# EAGLE schematic jetson (EAGLE 8.4.0)

## Sheet 1 of 2
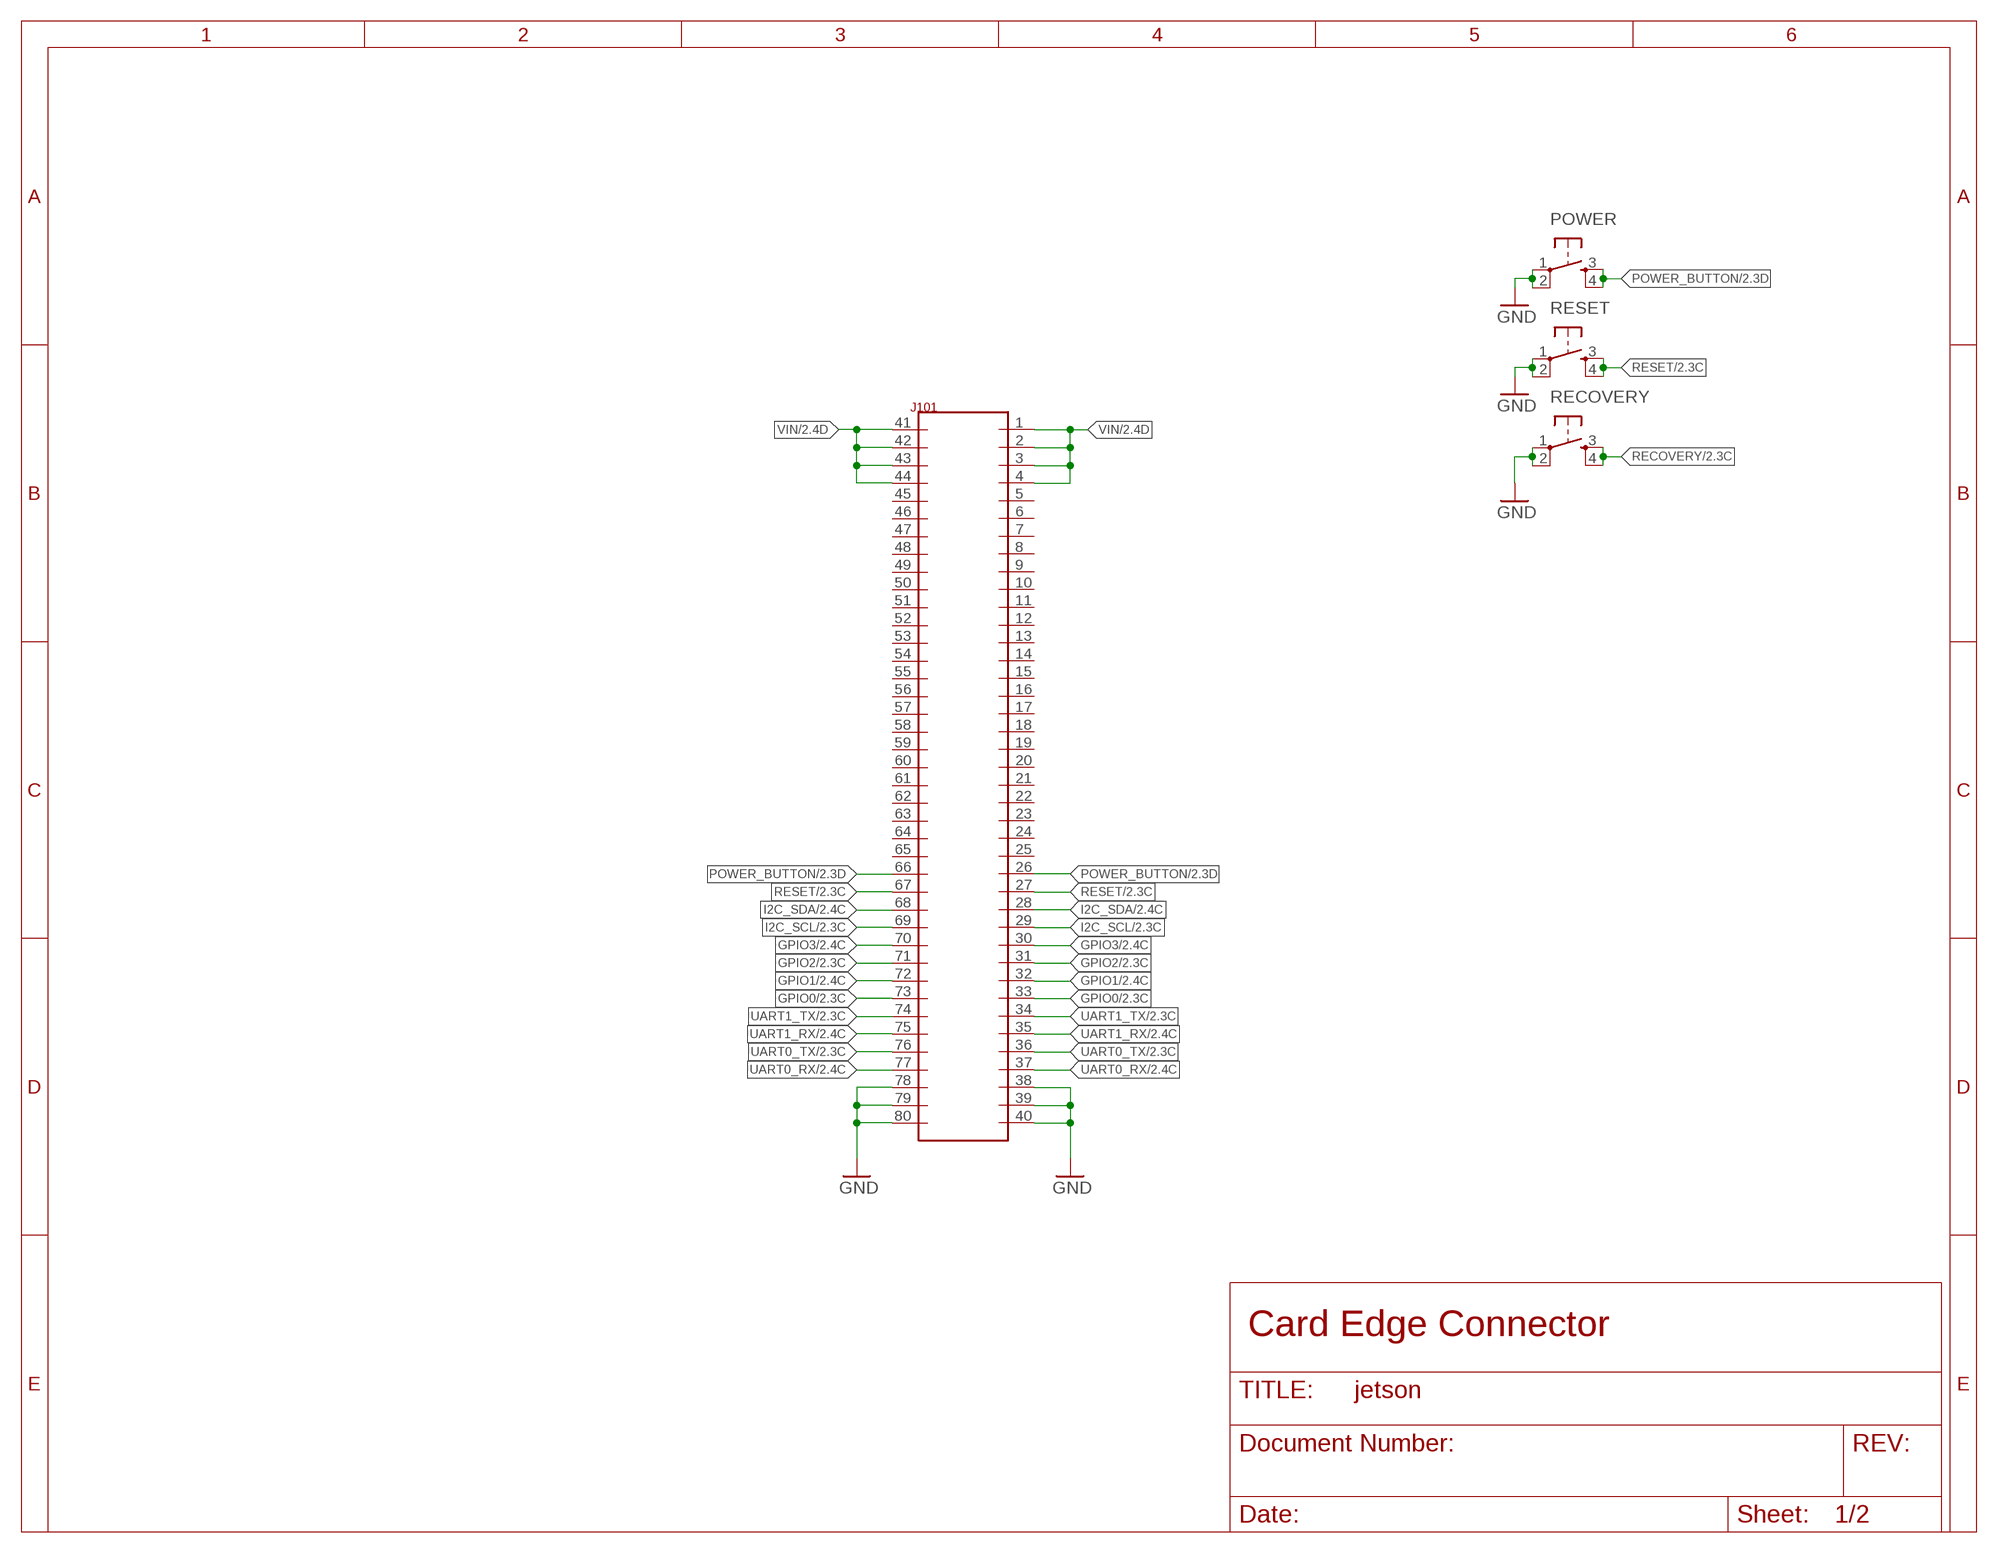
[diagram p0: schematic, sheet 1]

### Parts
J101  80-PIN-CARD-EDGE  [80-PIN-CARD-EDGE]
POWER  TAC_SWITCHPTH  [TACTILE-PTH]
RECOVERY  TAC_SWITCHPTH  [TACTILE-PTH]
RESET  TAC_SWITCHPTH  [TACTILE-PTH]

### Nets
GND: J101.38 J101.39 J101.40 J101.78 J101.79 J101.80 POWER.1 POWER.2 RECOVERY.1 RECOVERY.2 RESET.1 RESET.2 ; also sheet 2
GPIO0: J101.33 J101.73 ; also sheet 2
GPIO1: J101.32 J101.72 ; also sheet 2
GPIO2: J101.31 J101.71 ; also sheet 2
GPIO3: J101.30 J101.70 ; also sheet 2
I2C_SCL: J101.29 J101.69 ; also sheet 2
I2C_SDA: J101.28 J101.68 ; also sheet 2
POWER_BUTTON: J101.26 J101.66 POWER.3 POWER.4 ; also sheet 2
RECOVERY: RECOVERY.3 RECOVERY.4 ; also sheet 2
RESET: J101.27 J101.67 RESET.3 RESET.4 ; also sheet 2
UART0_RX: J101.37 J101.77 ; also sheet 2
UART0_TX: J101.36 J101.76 ; also sheet 2
UART1_RX: J101.35 J101.75 ; also sheet 2
UART1_TX: J101.34 J101.74 ; also sheet 2
VIN: J101.1 J101.2 J101.3 J101.4 J101.41 J101.42 J101.43 J101.44 ; also sheet 2
Unconnected: J101.5 J101.6 J101.7 J101.8 J101.9 J101.10 J101.11 J101.12 J101.13 J101.14 J101.15 J101.16 J101.17 J101.18 J101.19 J101.20 J101.21 J101.22 J101.23 J101.24 J101.25 J101.45 J101.46 J101.47 J101.48 J101.49 J101.50 J101.51 J101.52 J101.53 J101.54 J101.55 J101.56 J101.57 J101.58 J101.59 J101.60 J101.61 J101.62 J101.63 J101.64 J101.65

### Notes on the sheet
- Card Edge Connector

## Sheet 2 of 2
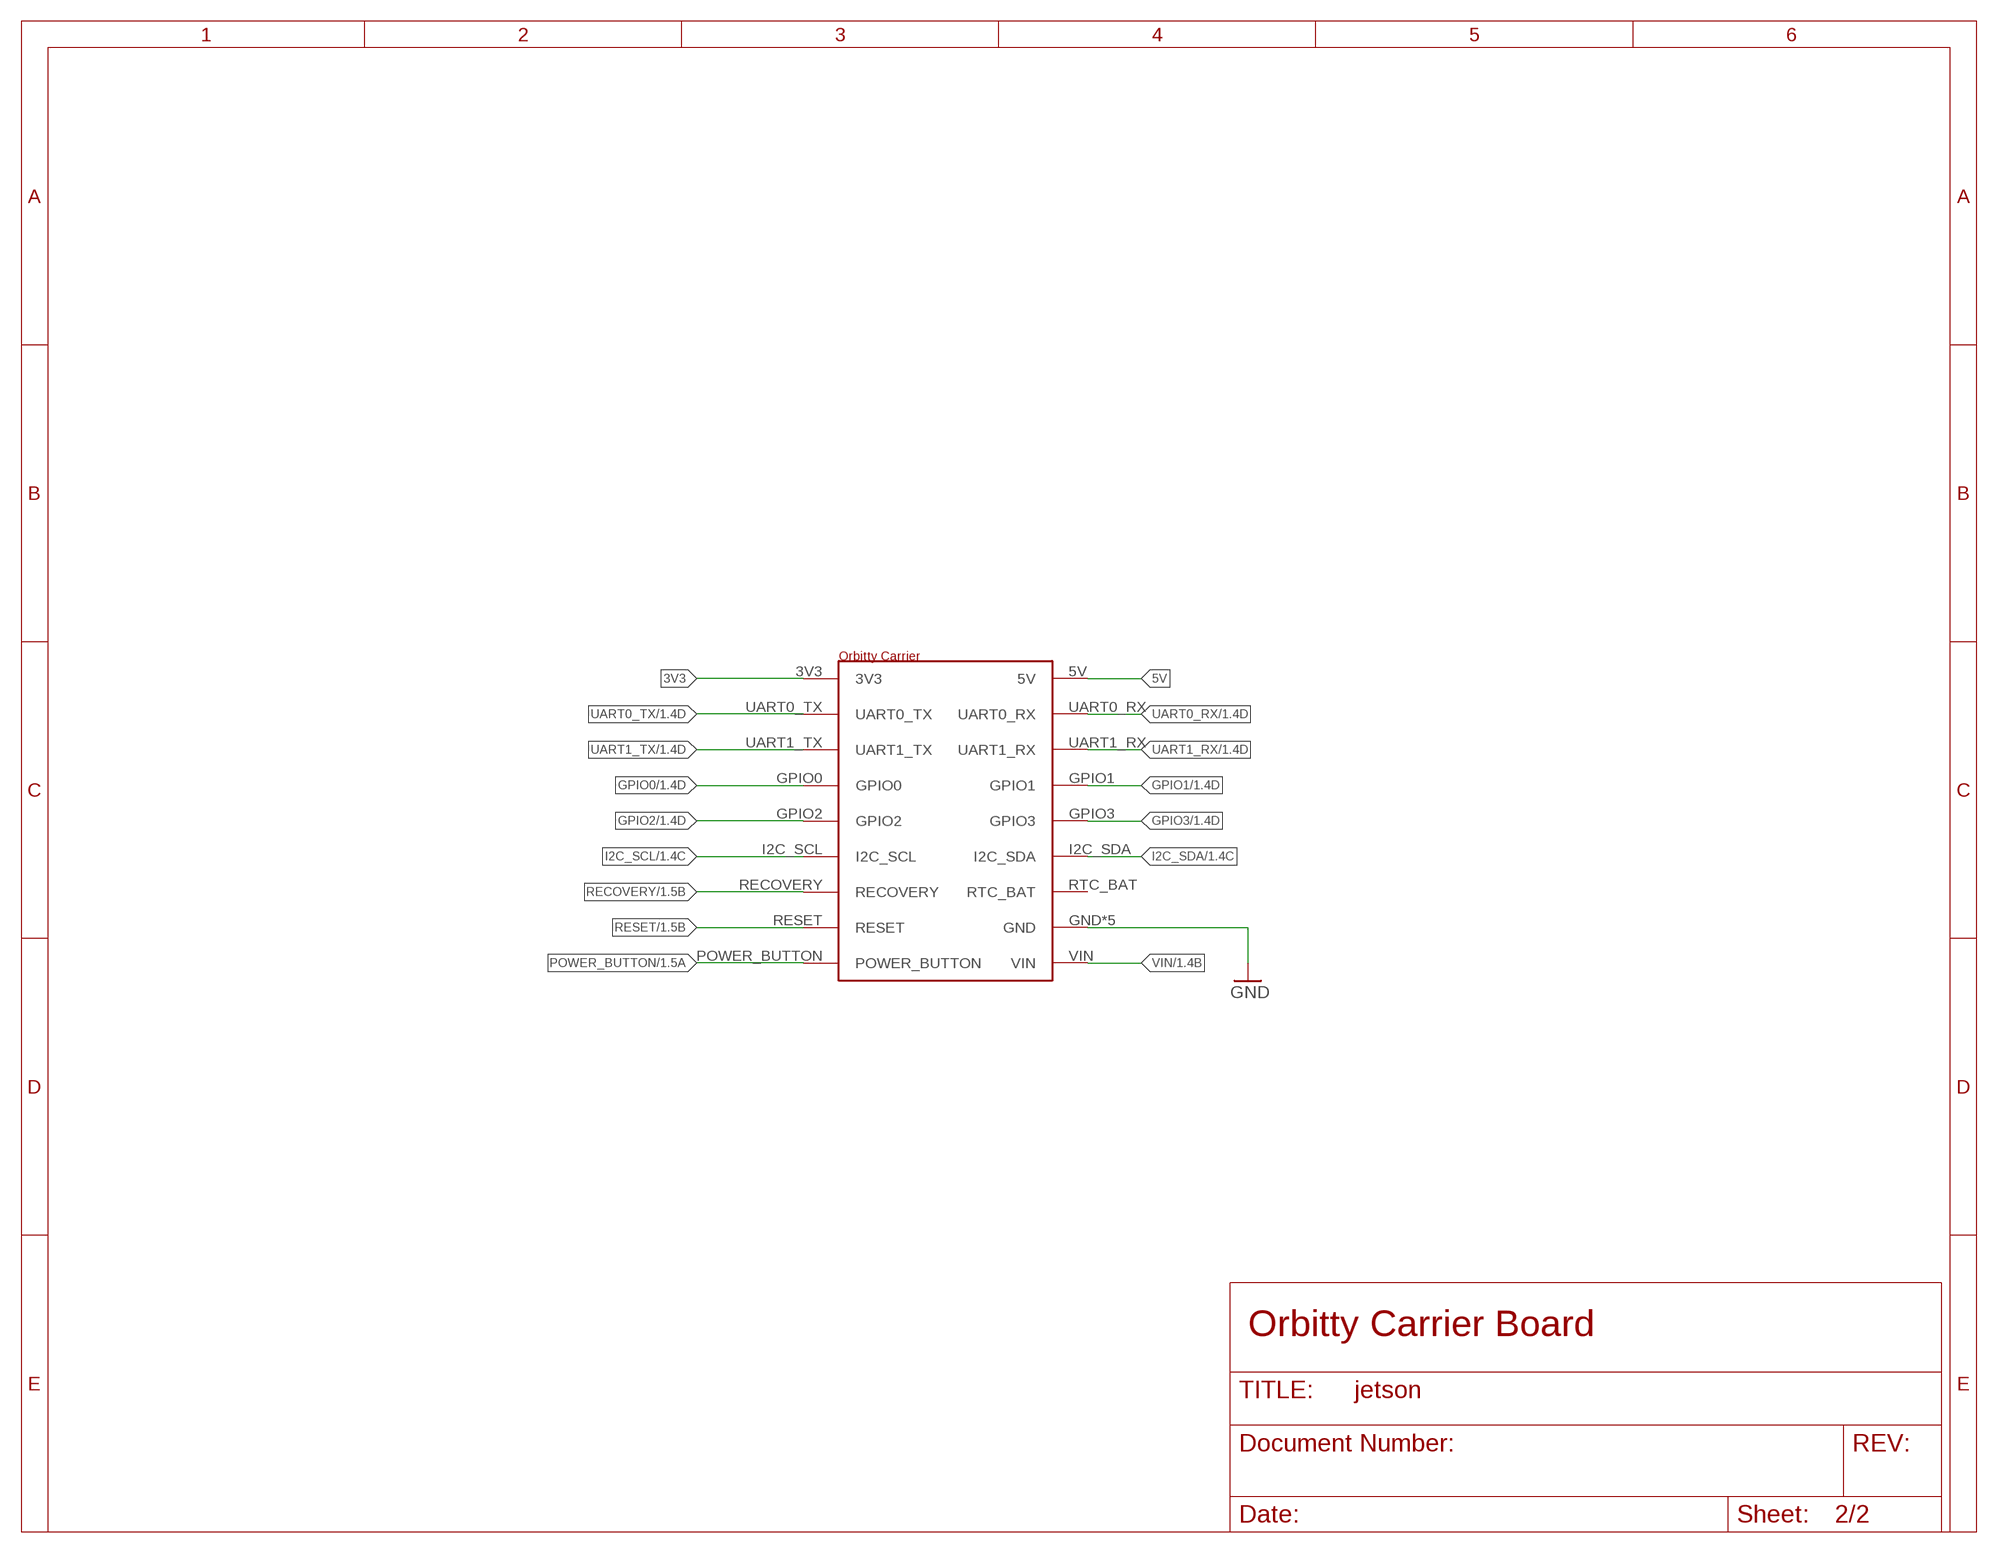
[diagram p1: schematic, sheet 2]

### Parts
U$1  ORBITTY_CARRIER  [ORBITTY_CARRIER]

### Nets
3V3: U$1.3V3
5V: U$1.5V
GND: U$1.GND U$1.GND1(GND) U$1.GND2(GND) U$1.GND3(GND) U$1.GND4(GND) ; also sheet 1
GPIO0: U$1.GPIO0 ; also sheet 1
GPIO1: U$1.GPIO1 ; also sheet 1
GPIO2: U$1.GPIO2 ; also sheet 1
GPIO3: U$1.GPIO3 ; also sheet 1
I2C_SCL: U$1.I2C_SCL ; also sheet 1
I2C_SDA: U$1.I2C_SDA ; also sheet 1
POWER_BUTTON: U$1.POWER_BUTTON ; also sheet 1
RECOVERY: U$1.RECOVERY ; also sheet 1
RESET: U$1.RESET ; also sheet 1
UART0_RX: U$1.UART0_RX ; also sheet 1
UART0_TX: U$1.UART0_TX ; also sheet 1
UART1_RX: U$1.UART1_RX ; also sheet 1
UART1_TX: U$1.UART1_TX ; also sheet 1
VIN: U$1.VIN ; also sheet 1
Unconnected: U$1.RTC_BAT

### Notes on the sheet
- Orbitty Carrier Board

## Library data of the parts
J101 = auv:80-PIN-CARD-EDGE
POWER RECOVERY RESET = auv:TAC_SWITCH: Momentary Switch Button commonly used for reset or general input. Spark Fun Electronics SKU : COM-00097 SMT- SWCH-08247
U$1 = auv:ORBITTY_CARRIER